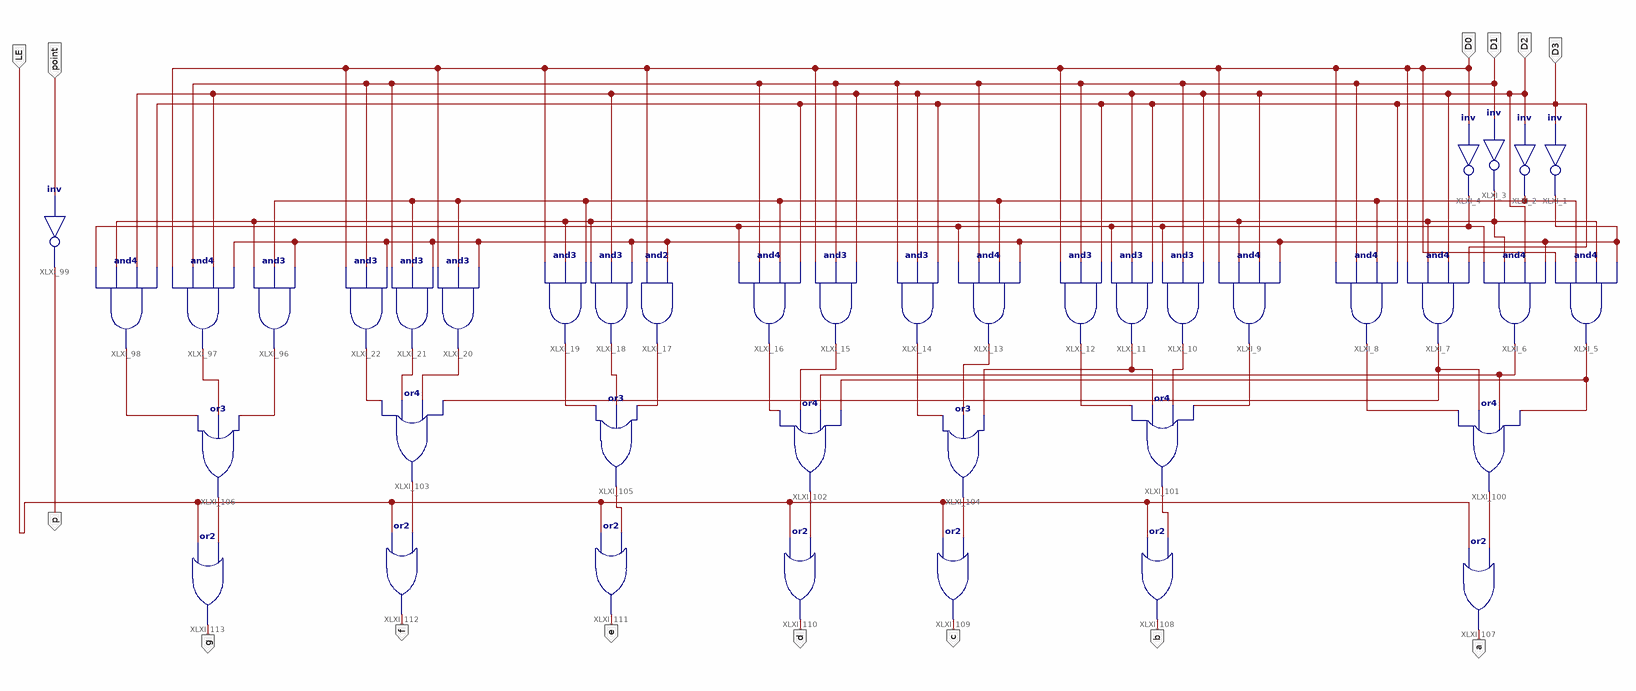
[diagram p0: schematic sheet 1]
// Xilinx ISE schematic MyMC14495.sch (kintex7) as structural Verilog: 40 symbols, 14 ports
module MyMC14495 (
  input  D0,
  input  D1,
  input  D2,
  input  D3,
  input  point,
  input  LE,
  output p,
  output g,
  output f,
  output e,
  output d,
  output c,
  output b,
  output a
);

  wire XLXN_14, XLXN_16, XLXN_17, XLXN_18, XLXN_25, XLXN_26, XLXN_27, XLXN_29, XLXN_30, XLXN_31, XLXN_32,
       XLXN_33, XLXN_34, XLXN_35, XLXN_36, XLXN_37, XLXN_38, XLXN_39, XLXN_41, XLXN_42, XLXN_43, XLXN_44,
       XLXN_45, XLXN_46, XLXN_48, XLXN_49, XLXN_50, XLXN_51, XLXN_52, XLXN_53, XLXN_54, XLXN_55;

  not XLXI_1 (XLXN_14, D3);
  not XLXI_2 (XLXN_16, D2);
  not XLXI_3 (XLXN_17, D1);
  not XLXI_4 (XLXN_18, D0);
  and XLXI_8 (XLXN_29, D0, D1, XLXN_16, D3);
  and XLXI_5 (XLXN_25, D0, XLXN_16, XLXN_17, XLXN_14);
  and XLXI_6 (XLXN_26, XLXN_18, XLXN_17, D2, XLXN_14);
  and XLXI_7 (XLXN_27, D0, XLXN_17, D2, D3);
  and XLXI_9 (XLXN_31, D0, XLXN_17, D2, XLXN_14);
  and XLXI_10 (XLXN_32, XLXN_18, D1, D2);
  and XLXI_11 (XLXN_33, XLXN_18, D2, D3);
  and XLXI_12 (XLXN_34, D0, D1, D3);
  and XLXI_13 (XLXN_36, XLXN_18, D1, XLXN_16, XLXN_14);
  and XLXI_14 (XLXN_37, D1, D2, D3);
  and XLXI_16 (XLXN_39, XLXN_18, D1, XLXN_16, D3);
  and XLXI_15 (XLXN_38, D0, D1, D2);
  and XLXI_17 (XLXN_41, D0, XLXN_14);
  and XLXI_18 (XLXN_42, XLXN_17, D2, XLXN_14);
  and XLXI_19 (XLXN_43, D0, XLXN_17, XLXN_16);
  and XLXI_20 (XLXN_44, D0, XLXN_16, XLXN_14);
  and XLXI_21 (XLXN_45, D1, XLXN_16, XLXN_14);
  and XLXI_22 (XLXN_46, D0, D1, XLXN_14);
  and XLXI_96 (XLXN_48, XLXN_17, XLXN_16, XLXN_14);
  and XLXI_97 (XLXN_49, D0, D1, D2, XLXN_14);
  and XLXI_98 (XLXN_50, XLXN_18, XLXN_17, D2, D3);
  not XLXI_99 (p, point);
  or XLXI_100 (XLXN_30, XLXN_29, XLXN_27, XLXN_26, XLXN_25);
  or XLXI_101 (XLXN_35, XLXN_34, XLXN_33, XLXN_32, XLXN_31);
  or XLXI_102 (XLXN_52, XLXN_39, XLXN_38, XLXN_26, XLXN_25);
  or XLXI_103 (XLXN_54, XLXN_46, XLXN_45, XLXN_44, XLXN_27);
  or XLXI_104 (XLXN_51, XLXN_37, XLXN_36, XLXN_33);
  or XLXI_105 (XLXN_53, XLXN_43, XLXN_42, XLXN_41);
  or XLXI_106 (XLXN_55, XLXN_50, XLXN_49, XLXN_48);
  or XLXI_107 (a, LE, XLXN_30);
  or XLXI_108 (b, LE, XLXN_35);
  or XLXI_109 (c, LE, XLXN_51);
  or XLXI_110 (d, LE, XLXN_52);
  or XLXI_111 (e, LE, XLXN_53);
  or XLXI_112 (f, LE, XLXN_54);
  or XLXI_113 (g, LE, XLXN_55);
endmodule
